# Altium schematic sheet Sheet2.SchDoc
size A1; SheetNumber: 2; SheetTotal: 2
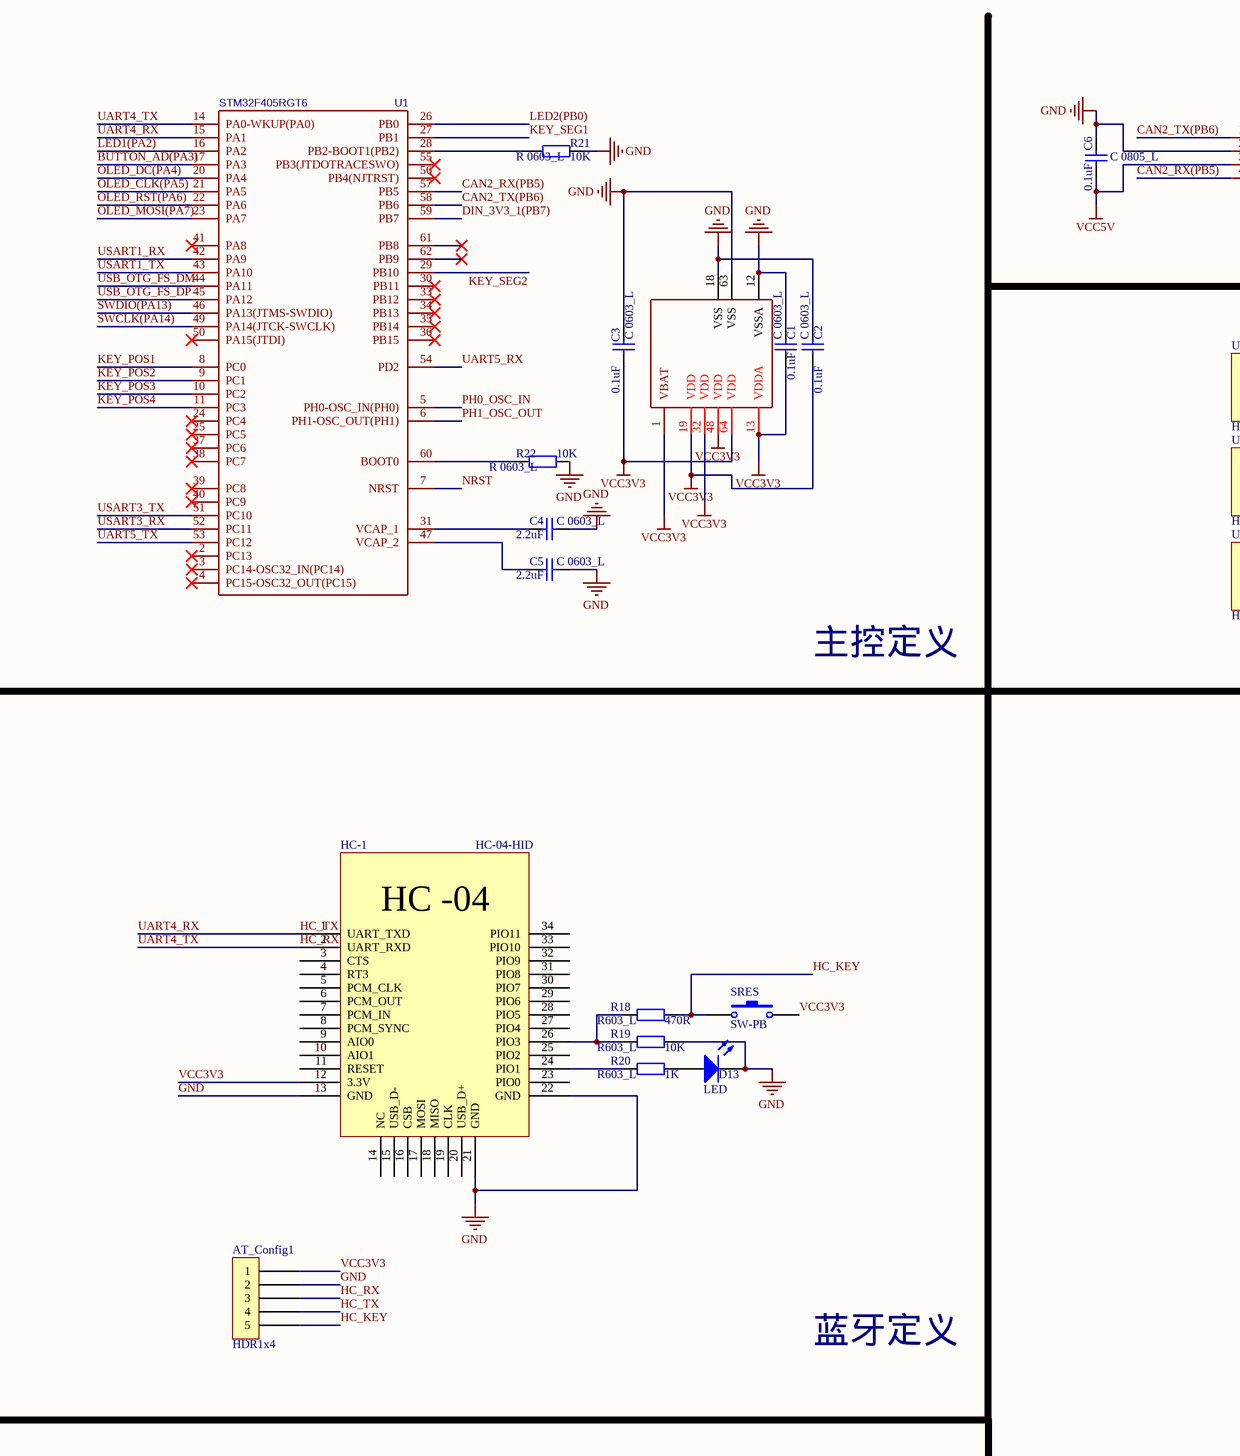
[diagram p0: Sheet2.SchDoc, top left]
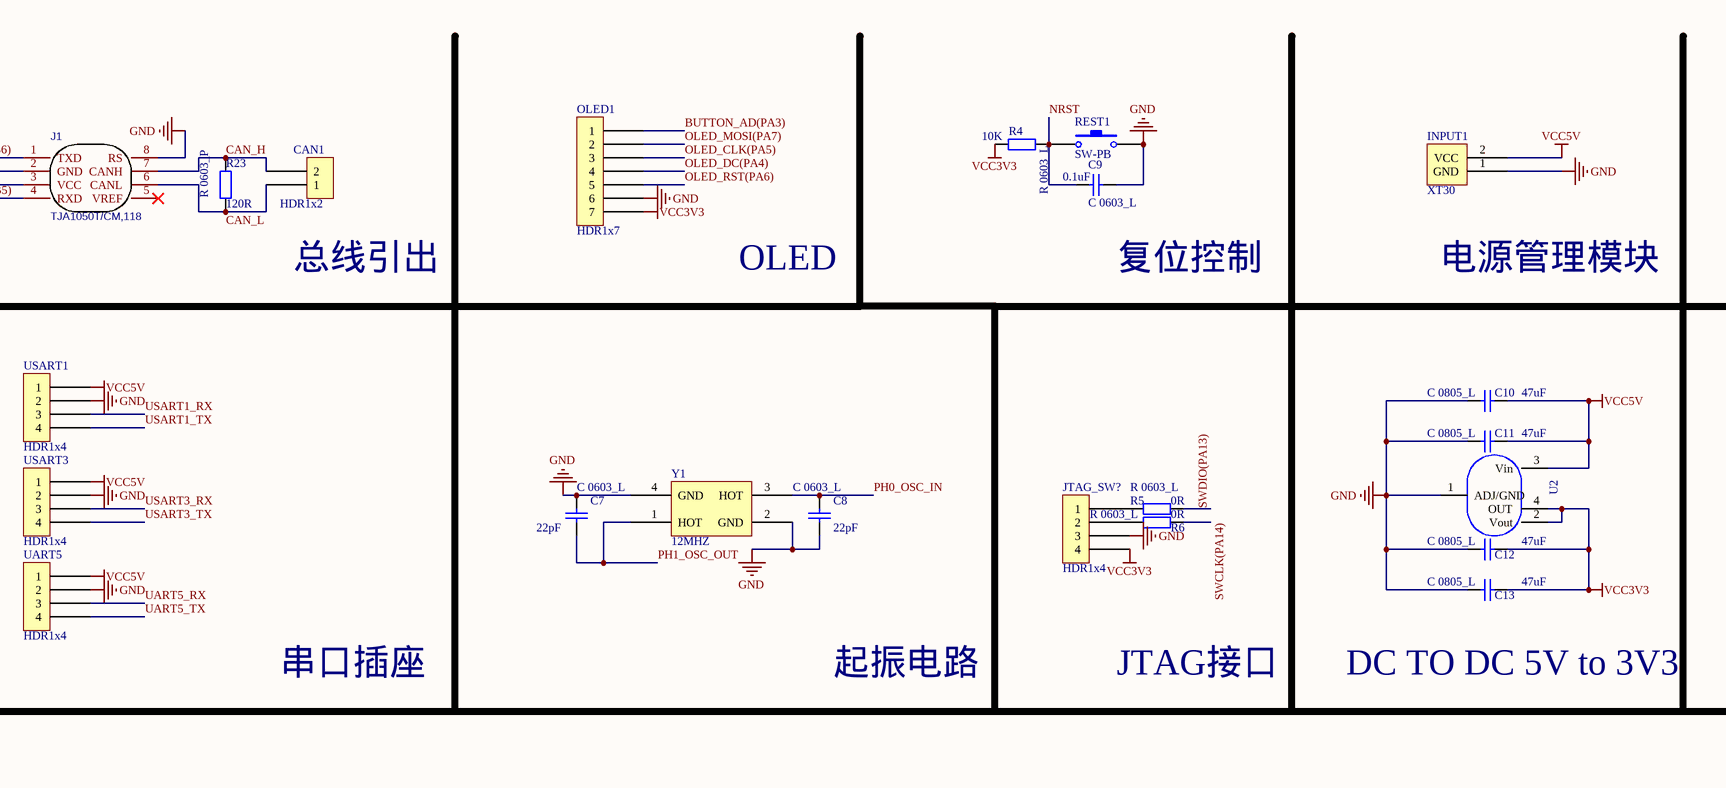
[diagram p1: Sheet2.SchDoc, top middle]
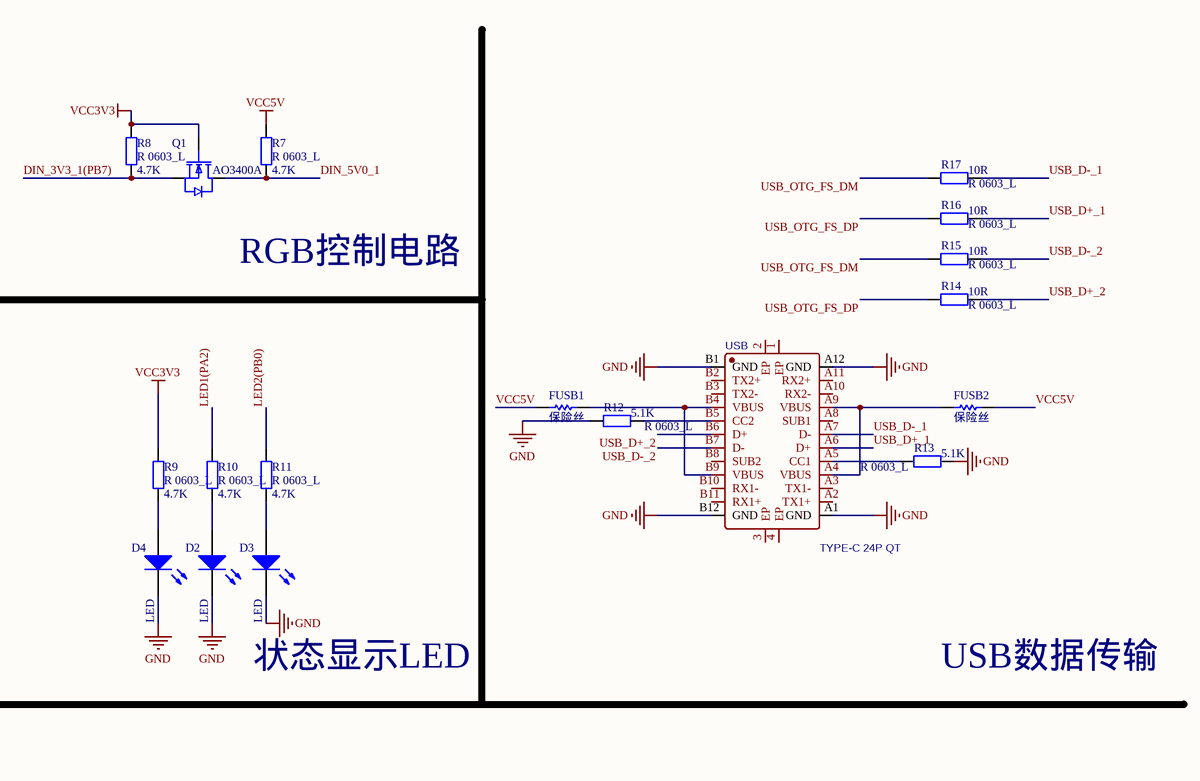
[diagram p2: Sheet2.SchDoc, top right]
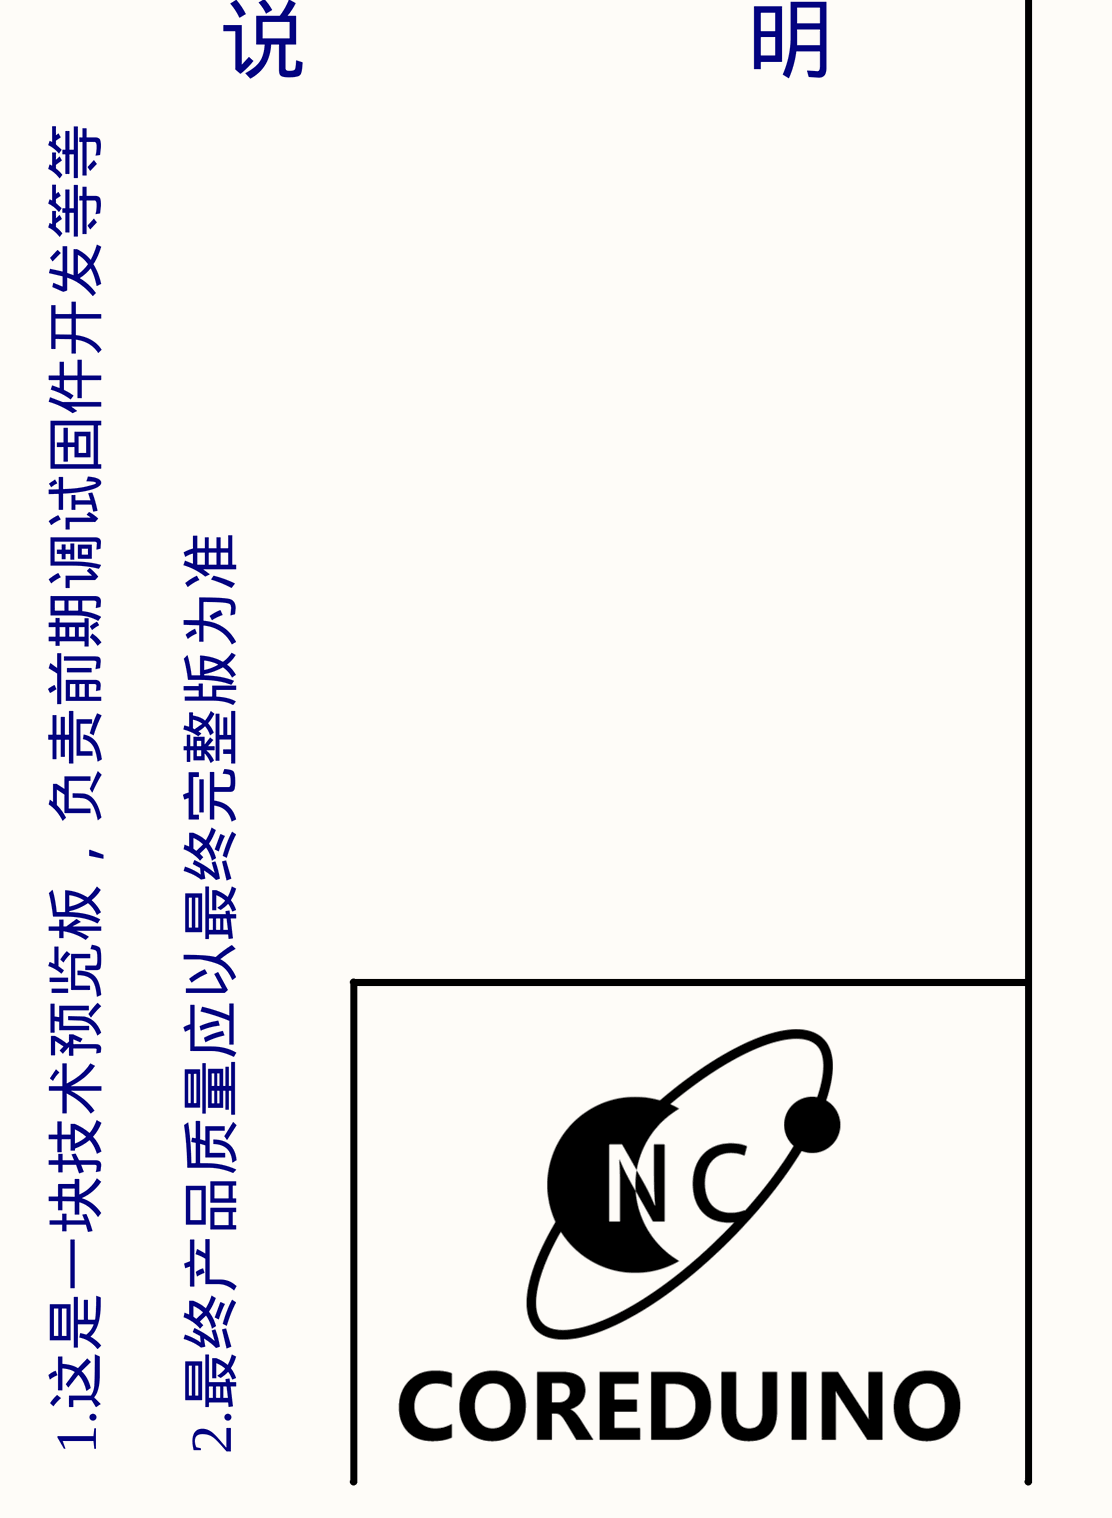
[diagram p3: Sheet2.SchDoc, bottom left]
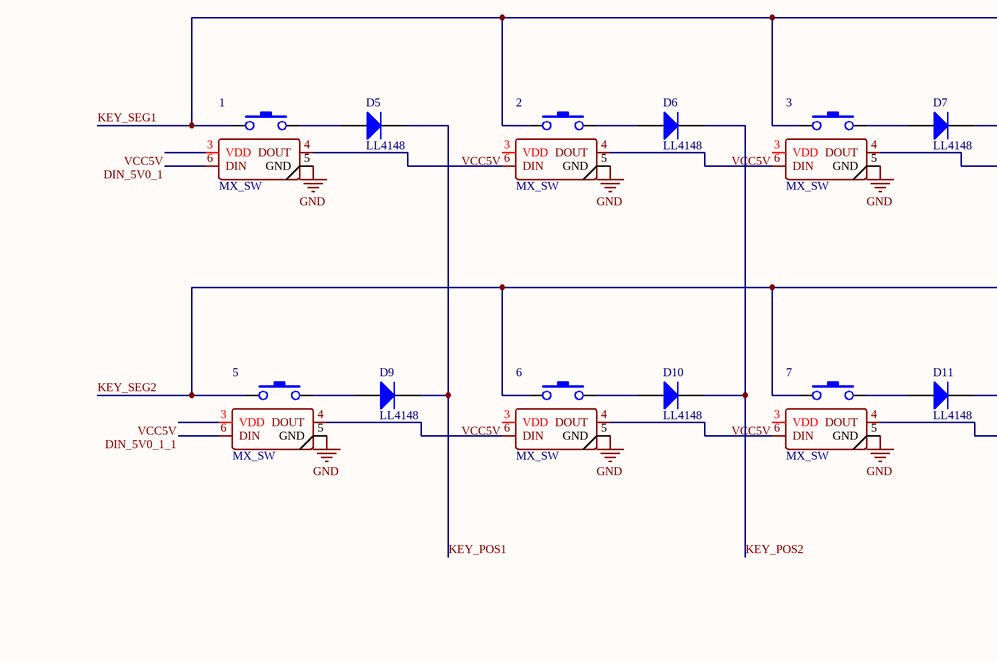
[diagram p4: Sheet2.SchDoc, bottom middle]
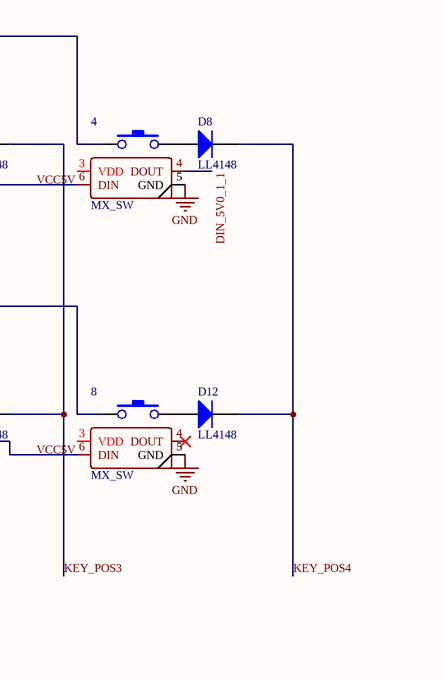
[diagram p5: Sheet2.SchDoc, bottom right]

## Parts
1  MX_SW  [MX_SW-HOTPLUG]
2  MX_SW  [MX_SW-HOTPLUG]
3  MX_SW  [MX_SW-HOTPLUG]
4  MX_SW  [MX_SW-HOTPLUG]
5  MX_SW  [MX_SW-HOTPLUG]
6  MX_SW  [MX_SW-HOTPLUG]
7  MX_SW  [MX_SW-HOTPLUG]
8  MX_SW  [MX_SW-HOTPLUG]
AT_Config1  HDR1x4  [MX 1.25-WS-5P]
C1  C 0603_L  value 0.1uF  [C 0603_L]
C2  C 0603_L  value 0.1uF  [C 0603_L]
C3  C 0603_L  value 0.1uF  [C 0603_L]
C4  C 0603_L  value 2.2uF  [C 0603_L]
C5  C 0603_L  value 2.2uF  [C 0603_L]
C6  C 0805_L  value 0.1uF  [C 0805_L]
C7  C 0603_L  value 22pF  [C 0603_L]
C8  C 0603_L  value 22pF  [C 0603_L]
C9  C 0603_L  value 0.1uF  [C 0603_L]
C10  C 0805_L  value 47uF  [C 0805_L]
C11  C 0805_L  value 47uF  [C 0805_L]
C12  C 0805_L  value 47uF  [C 0805_L]
C13  C 0805_L  value 47uF  [C 0805_L]
CAN1  HDR1x2  [GH1.25-立贴-2P]
D2  LED  [LED 0805R]
D3  LED  [LED 0805R]
D4  LED  [LED 0805R]
D5  LL4148  [LL-34_L3.7-W1.6-RD]
D6  LL4148  [LL-34_L3.7-W1.6-RD]
D7  LL4148  [LL-34_L3.7-W1.6-RD]
D8  LL4148  [LL-34_L3.7-W1.6-RD]
D9  LL4148  [LL-34_L3.7-W1.6-RD]
D10  LL4148  [LL-34_L3.7-W1.6-RD]
D11  LL4148  [LL-34_L3.7-W1.6-RD]
D12  LL4148  [LL-34_L3.7-W1.6-RD]
D13  LED  [LED 0805R]
FUSB1  保险丝  [FU 1206]
FUSB2  保险丝  [FU 1206]
HC-1  HC-04-HID  [HC-04]
INPUT1  XT30  [XT30PW-M]
J1  TJA1050T/CM,118  [SOIC-8_150MIL]
JTAG_SW?  HDR1x4  [GH1.25-立贴-4P]
OLED1  HDR1x7  [GH1.25-立贴-7P]
Q1  AO3400A  [AO3400A]
R4  R 0603_L  value 10K  [R 0603_L]
R5  R 0603_L  value 0R  [R 0603_L]
R6  R 0603_L  value 0R  [R 0603_L]
R7  R 0603_L  value 4.7K  [R 0603_L]
R8  R 0603_L  value 4.7K  [R 0603_L]
R9  R 0603_L  value 4.7K  [R 0603_L]
R10  R 0603_L  value 4.7K  [R 0603_L]
R11  R 0603_L  value 4.7K  [R 0603_L]
R12  R 0603_L  value 5.1K  [R 0603_L]
R13  R 0603_L  value 5.1K  [R 0603_L]
R14  R 0603_L  value 10R  [R 0603_L]
R15  R 0603_L  value 10R  [R 0603_L]
R16  R 0603_L  value 10R  [R 0603_L]
R17  R 0603_L  value 10R  [R 0603_L]
R18  R603_L  value 470R  [R 0603_L]
R19  R603_L  value 10K  [R 0603_L]
R20  R603_L  value 1K  [R 0603_L]
R21  R 0603_L  value 10K  [R 0603_L]
R22  R 0603_L  value 10K  [R 0603_L]
R23  R 0603_P  value 120R  [0603P]
REST1  SW-PB  [SMD-3.2*4.2]
SRES  SW-PB  [SMD-3.2*4.2]
U1  STM32F405RGT6  [STM32F405RGT6]
U2  SPX1117M3-L-3-3  [SPX1117M3-L-3-3/TR]  (value not drawn)
UART5  HDR1x4  [GH1.25-立贴-4P]
USART1  HDR1x4  [GH1.25-立贴-4P]
USART3  HDR1x4  [GH1.25-立贴-4P]
USB  TYPE-C 24P QT  [USB-C-SMD_TYPE-C-24P-QT]
Y1  12MHZ  [SMD-3225_4P]

## Nets
GND: 1.5(GND) 2.5(GND) 3.5(GND) 4.5(GND) 5.5(GND) 6.5(GND) 7.5(GND) 8.5(GND) AT_Config1.2 C1.2 C2.2 C3.2 C4.2 C5.2 C6.2 C7.2 C8.1 C9.2 C10.1 C11.1 C12.1 C13.1 D2.2(K) D3.2(K) D4.2(K) D13.2(K) HC-1.13(GND) HC-1.21(GND) HC-1.22(GND) INPUT1.1(GND) J1.2(GND) J1.8(RS) JTAG_SW?.3 OLED1.6 R12.1 R13.2 R19.2 R21.2 R22.2 REST1.2 U1.12(VSSA) U1.18(VSS) U1.63(VSS) U2.1(ADJ/GND) UART5.2 USART1.2 USART3.2 USB.A1(GND) USB.A12(GND) USB.B1(GND) USB.B12(GND) Y1.2(GND) Y1.4(GND)
VCC3V3: AT_Config1.1 C1.1 C2.1 C3.1 C12.2 C13.2 HC-1.12(3.3V) JTAG_SW?.4 OLED1.7 Q1.1(G) R4.1 R8.2 R9.2 SRES.2 U1.1(VBAT) U1.13(VDDA) U1.19(VDD) U1.32(VDD) U1.48(VDD) U1.64(VDD) U2.2(Vout) U2.4(OUT)
VCC5V: 1.3(VDD) 2.3(VDD) 3.3(VDD) 4.3(VDD) 5.3(VDD) 6.3(VDD) 7.3(VDD) 8.3(VDD) C6.1 C10.2 C11.2 FUSB1.1 FUSB2.2 INPUT1.2(VCC) J1.3(VCC) R7.2 U2.3(Vin) UART5.1 USART1.1 USART3.1
BUTTON_AD(PA3): OLED1.1 U1.17(PA3)
CAN2_RX(PB5): J1.4(RXD) U1.57(PB5)
CAN2_TX(PB6): J1.1(TXD) U1.58(PB6)
CAN_H: CAN1.2 J1.7(CANH) R23.2
CAN_L: CAN1.1 J1.6(CANL) R23.1
DIN_3V3_1(PB7): Q1.2(S) R8.1 U1.59(PB7)
DIN_5V0_1: 1.6(DIN) Q1.3(D) R7.1
DIN_5V0_1_1: 4.4(DOUT) 5.6(DIN)
HC_KEY: AT_Config1.5 R18.2 SRES.1
HC_RX: AT_Config1.3 HC-1.2(UART_RXD) U1.14(PA0-WKUP(PA0))  [also labelled UART4_TX]
HC_TX: AT_Config1.4 HC-1.1(UART_TXD) U1.15(PA1)  [also labelled UART4_RX]
KEY_POS1: D5.2(K) D9.2(K) U1.8(PC0)
KEY_POS2: D6.2(K) D10.2(K) U1.9(PC1)
KEY_POS3: D7.2(K) D11.2(K) U1.10(PC2)
KEY_POS4: D8.2(K) D12.2(K) U1.11(PC3)
KEY_SEG1: 1.1 2.1 3.1 4.1 U1.27(PB1)
KEY_SEG2: 5.1 6.1 7.1 8.1 U1.29(PB10)
LED1(PA2): R10.2 U1.16(PA2)
LED2(PB0): R11.2 U1.26(PB0)
NRST: C9.1 R4.2 REST1.1 U1.7(NRST)
OLED_CLK(PA5): OLED1.3 U1.21(PA5)
OLED_DC(PA4): OLED1.4 U1.20(PA4)
OLED_MOSI(PA7): OLED1.2 U1.23(PA7)
OLED_RST(PA6): OLED1.5 U1.22(PA6)
PH0_OSC_IN: C8.2 U1.5(PH0-OSC_IN(PH0)) Y1.3(HOT)
PH1_OSC_OUT: C7.1 U1.6(PH1-OSC_OUT(PH1)) Y1.1(HOT)
SWCLK(PA14): R6.2 U1.49(PA14(JTCK-SWCLK))
SWDIO(PA13): R5.2 U1.46(PA13(JTMS-SWDIO))
UART5_RX: U1.54(PD2) UART5.3
UART5_TX: U1.53(PC12) UART5.4
USART1_RX: U1.42(PA9) USART1.3
USART1_TX: U1.43(PA10) USART1.4
USART3_RX: U1.52(PC11) USART3.3
USART3_TX: U1.51(PC10) USART3.4
USB_D+_1: R16.2 USB.A6(D+)
USB_D+_2: R14.2 USB.B6(D+)
USB_D-_1: R17.2 USB.A7(D-)
USB_D-_2: R15.2 USB.B7(D-)
USB_OTG_FS_DM: R15.1 R17.1 U1.44(PA11)
USB_OTG_FS_DP: R14.1 R16.1 U1.45(PA12)
Net1_2: 1.2 D5.1(A)
Net1_4: 1.4(DOUT) 2.6(DIN)
Net2_2: 2.2 D6.1(A)
Net2_4: 2.4(DOUT) 3.6(DIN)
Net3_2: 3.2 D7.1(A)
Net3_4: 3.4(DOUT) 4.6(DIN)
Net4_2: 4.2 D8.1(A)
Net5_2: 5.2 D9.1(A)
Net5_4: 5.4(DOUT) 6.6(DIN)
Net6_2: 6.2 D10.1(A)
Net6_4: 6.4(DOUT) 7.6(DIN)
Net7_2: 7.2 D11.1(A)
Net7_4: 7.4(DOUT) 8.6(DIN)
Net8_2: 8.2 D12.1(A)
NetC4_1: C4.1 U1.31(VCAP_1)
NetC5_1: C5.1 U1.47(VCAP_2)
NetD2_1: D2.1(A) R10.1
NetD3_1: D3.1(A) R11.1
NetD4_1: D4.1(A) R9.1
NetD13_1: D13.1(A) R20.2
NetFUSB1_2: FUSB1.2 USB.B4(VBUS) USB.B9(VBUS)
NetFUSB2_1: FUSB2.1 USB.A4(VBUS) USB.A9(VBUS)
NetHC-1_24: HC-1.24(PIO1) R20.1
NetHC-1_26: HC-1.26(PIO3) R18.1 R19.1
NetJTAG_SW?_1: JTAG_SW?.1 R5.1
NetJTAG_SW?_2: JTAG_SW?.2 R6.1
NetR12_2: R12.2 USB.B5(CC2)
NetR13_1: R13.1 USB.A5(CC1)
NetR21_1: R21.1 U1.28(PB2-BOOT1(PB2))
NetR22_1: R22.1 U1.60(BOOT0)

Not connected (* = marked no-connect by the designer): 8 4(DOUT)*; HC-1 3(CTS) 4(RT3) 5(PCM_CLK) 6(PCM_OUT) 7(PCM_IN) 8(PCM_SYNC) 9(AIO0) 10(AIO1) 11(RESET) 14(NC) 15(USB_D-) 16(CSB) 17(MOSI) 18(MISO) 19(CLK) 20(USB_D+) 23(PIO0) 25(PIO2) 27(PIO4) 28(PIO5) 29(PIO6) 30(PIO7) 31(PIO8) 32(PIO9) 33(PIO10) 34(PIO11); J1 5(VREF)*; U1 2(PC13)* 3(PC14-OSC32_IN(PC14))* 4(PC15-OSC32_OUT(PC15))* 24(PC4)* 25(PC5)* 30(PB11)* 33(PB12)* 34(PB13)* 35(PB14)* 36(PB15)* 37(PC6)* 38(PC7)* 39(PC8)* 40(PC9)* 41(PA8)* 50(PA15(JTDI))* 55(PB3(JTDOTRACESWO))* 56(PB4(NJTRST))* 61(PB8)* 62(PB9)*; USB 1(EP) 2(EP) 3(EP) 4(EP) A2(TX1+) A3(TX1-) A8(SUB1) A10(RX2-) A11(RX2+) B2(TX2+) B3(TX2-) B8(SUB2) B10(RX1-) B11(RX1+)

## Notes on the sheet
- 总线引出
- OLED
- 复位控制
- 电源管理模块
- RGB控制电路
- 主控定义
- 串口插座
- 起振电路
- JTAG接口
- DC TO DC 5V to 3V3
- 状态显示LED
- USB数据传输
- 蓝牙定义
- 说                    明
- 1.这是一块技术预览板，负责前期调试固件开发等等
- 2.最终产品质量应以最终完整版为准
- (in symbol HC-04) HC -04

## Library data of the parts
1-8 = MX_SW-Hot
AT_Config1 = HDR1x5_卧
C1-C5 C7-C9 = C 0603_L: Capacitor; Published: 8-Jun-2000; LatestRevisionDate: 17-Jul-2002; LatestRevisionNote: Re-released for DXP Platform.; PackageReference: RAD-0.3; Publisher: Altium Limited; PackageDescription: Radial Cap, Thru-Hole; 2 Leads; 0.3 in Pin Spacing
C6 C10-C13 = C 0805_L: Capacitor; Published: 8-Jun-2000; LatestRevisionDate: 17-Jul-2002; LatestRevisionNote: Re-released for DXP Platform.; PackageReference: RAD-0.3; Publisher: Altium Limited; PackageDescription: Radial Cap, Thru-Hole; 2 Leads; 0.3 in Pin Spacing
D2-D4 D13 = LED 0805R 红: Typical INFRARED GaAs LED; Published: 8-Jun-2000; LatestRevisionDate: 08-Jul-2005; LatestRevisionNote: Mech Layer 1 removed.; PackageReference: LED-0; Publisher: Altium Limited; PackageDescription: LED; 2 Leads
D5-D12 = Diode: Default Diode; Published: 8-Jun-2000; LatestRevisionDate: 17-Jul-2002; LatestRevisionNote: Re-released for DXP Platform.; PackageVersion: Sep-1996; PackageReference: SMC; Publisher: Altium Limited; PackageDescription: DO-214-AB/SMC; 2 C-Bend Leads; Body 7.9 x 5.9 mm, inc. leads (LxW); Code_JEDEC: DO-214-AB
FUSB1 FUSB2 = FU: Published: 8-Jun-2000; LatestRevisionDate: 17-Jul-2002; LatestRevisionNote: Re-released for DXP Platform.; PackageReference: AXIAL-0.3; Publisher: Altium Limited; PackageDescription: Axial Device, Thru-Hole; 2 Leads; 0.3 in Pin Spacing
HC-1 = HC-04
J1 = TJA1050T/CM,118: BOM_Manufacturer: NXP; BOM_Supplier: LCSC; BOM_Manufacturer Part: TJA1050T/CM,118; BOM_Supplier Part: C6952; BOM_JLCPCB Part Class: Basic Part; spicePre: U; spiceSymbolName: TJA1050T/CM,118
JTAG_SW? UART5 USART1 USART3 = HDR1x4_卧
Q1 = 2N7002,215: Manufacturer: Nexperia(安世); Add into BOM: yes; Type: N沟道; Drain Source Voltage (Vdss): 60V; Continuous Drain Current (Id): 300mA; Power Dissipation (Pd): 830mW; Drain Source On Resistance (RDS(on)@Vgs,Id): 5Ω@10V,500mA; Gate Threshold Voltage (Vgs(th)@Id): 2.5V@250A; Symbol: 2N7002,215; Device: 2N7002,215; LCSC Part Name: N沟道 60V 300mA; Supplier Part: C65189; Manufacturer Part: 2N7002,215; Supplier Footprint: SOT-23(SOT-23-3); JLCPCB Part Class: Extended Part; Datasheet: https://atta.szlcsc.com/upload/public/pdf/source/20170103/1483439882638.pdf; Supplier: LCSC; Convert to PCB: yes
R4-R22 = R 0603_L: Resistor; Published: 8-Jun-2000; LatestRevisionDate: 17-Jul-2002; LatestRevisionNote: Re-released for DXP Platform.; PackageReference: AXIAL-0.4; Publisher: Altium Limited; PackageDescription: Axial Device, Thru-Hole; 2 Leads; 0.4 in Pin Spacing
R23 = R 0603_P: Resistor; Published: 8-Jun-2000; LatestRevisionDate: 17-Jul-2002; LatestRevisionNote: Re-released for DXP Platform.; PackageReference: AXIAL-0.4; Publisher: Altium Limited; PackageDescription: Axial Device, Thru-Hole; 2 Leads; 0.4 in Pin Spacing
REST1 SRES = SW-PB: Switch; Published: 24-Mar-1999; LatestRevisionDate: 17-Jul-2002; LatestRevisionNote: Re-released for DXP Platform.; PackageReference: SPST-2; Publisher: Altium Limited; PackageDescription: Switch; 2 Leads
U1 = STM32F405RGT6: BOM_Manufacturer: ST; subpart_no: 1; tags: STM32; BOM_Supplier Part: C15742; BOM_Supplier: LCSC; BOM_Manufacturer Part: STM32F405RGT6; image: http://image.lceda.cn/szlcsc/C15742.jpg; BOM_JLCPCB Part Class: Extended Part; spicePre: U; spiceSymbolName: STM32F405RGT6
U2 = SPX1117M3-L-3-3: Manufacturer: UTC(友顺); Symbol: LM317G-AA3-R; Add into BOM: yes; Output Type: 可调; Output Polarity: 正; Number of Outputs: 1; Maximum Input Voltage: 40V; Output Voltage: 1.3V~37V; Dropout Voltage: 5V@(10mA); Output Current: 1A; Device: LM317G-AA3-R; LCSC Part Name: Vin=40V Vout=1.3V~37V 1A; Supplier Part: C19651; Manufacturer Part: LM317G-AA3-R; Supplier Footprint: SOT-223; JLCPCB Part Class: Extended Part; Datasheet: https://atta.szlcsc.com/upload/public/pdf/source/20160416/1460799387250.pdf; Supplier: LCSC; Convert to PCB: yes
USB = TYPE-C 24P QT: BOM_Manufacturer: SHOU HAN(首韩); Contributor: LCSC; BOM_Supplier: LCSC; BOM_Supplier Part: C2681555; BOM_Manufacturer Part: TYPE-C 24P QT; BOM_JLCPCB Part Class: Extended Part; spicePre: U; spiceSymbolName: TYPE-C 24P QT
Y1 = 3325 12Mhz: 3325 12MHZ 无源晶振